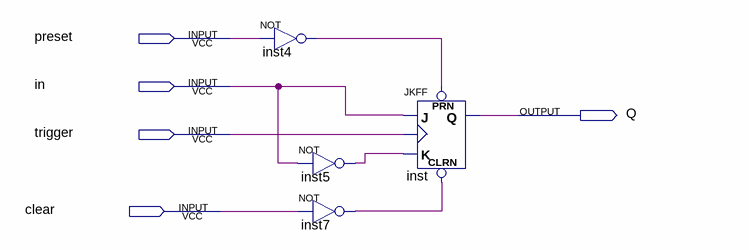
[diagram p0: schematic sheet]
// Quartus schematic flipflop_jk.bdf as structural Verilog: 4 symbols, 5 pins
module flipflop_jk (
  input  preset,
  input  in,
  input  trigger,
  input  clear,
  output Q
);

  wire inst4_out, inst5_out, inst7_out;

  not inst4 (inst4_out, preset);
  not inst5 (inst5_out, in);
  not inst7 (inst7_out, clear);
  JKFF inst (.PRN(inst4_out), .CLRN(inst7_out), .K(inst5_out), .J(in), .CLK(trigger), .Q(Q));
endmodule
